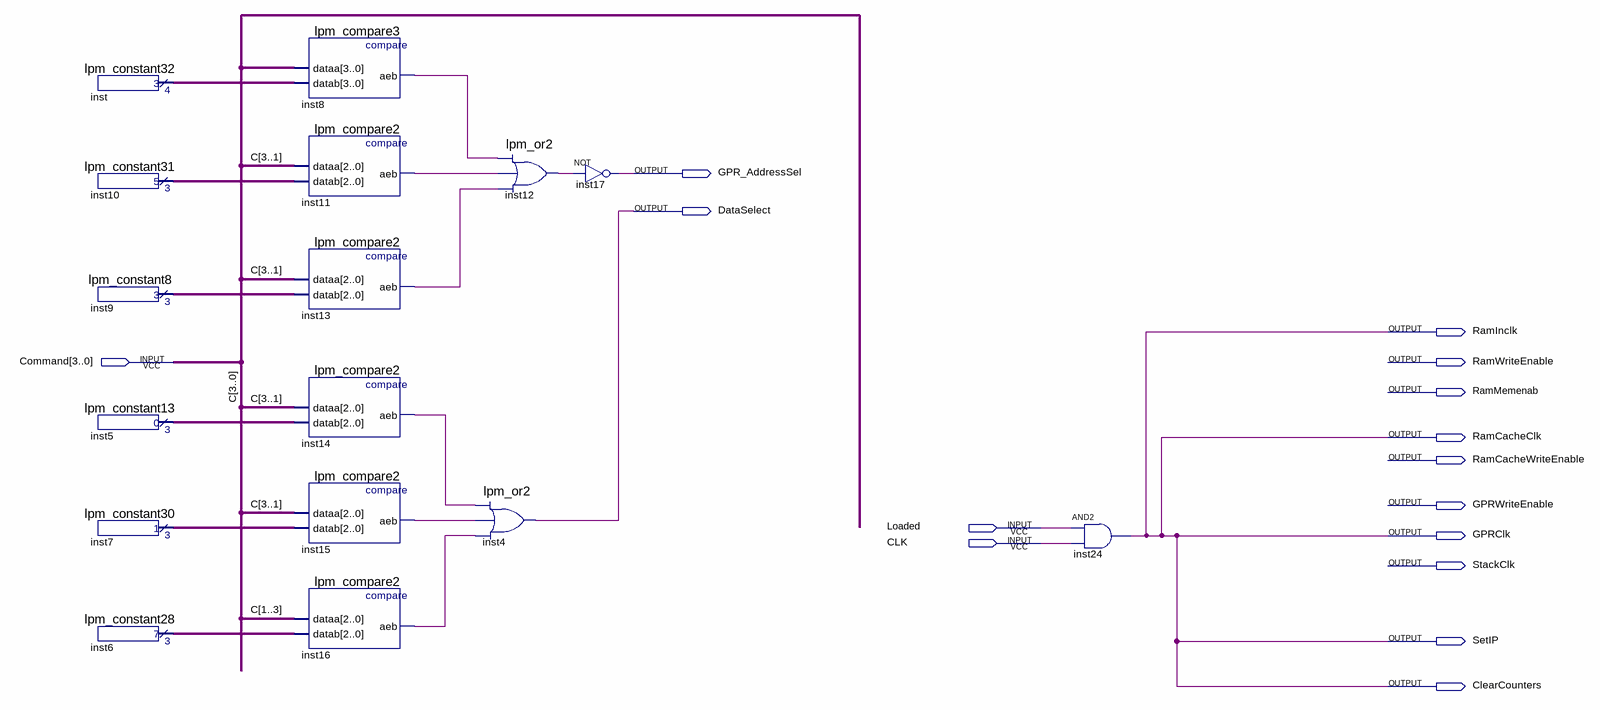
[diagram p0: schematic sheet]
// Quartus schematic SelectDataAndGPRAddress.bdf as structural Verilog: 16 symbols, 15 pins
module SelectDataAndGPRAddress (
  input  [3:0] Command,
  input  Loaded,
  input  CLK,
  output GPR_AddressSel,
  output DataSelect,
  output RamInclk,
  output RamWriteEnable,
  output RamMemenab,
  output RamCacheClk,
  output RamCacheWriteEnable,
  output GPRWriteEnable,
  output GPRClk,
  output StackClk,
  output SetIP,
  output ClearCounters
);

  wire inst8_aeb, inst11_aeb, inst12_result, inst13_aeb, inst14_aeb, inst15_aeb, inst16_aeb;
  wire [2:0] inst5_result, inst6_result, inst7_result, inst9_result, inst10_result;
  wire [3:0] inst_result;

  lpm_constant32 inst (.result(inst_result));
  lpm_constant31 inst10 (.result(inst10_result));
  lpm_constant8 inst9 (.result(inst9_result));
  lpm_constant13 inst5 (.result(inst5_result));
  lpm_constant30 inst7 (.result(inst7_result));
  lpm_constant28 inst6 (.result(inst6_result));
  lpm_compare3 inst8 (.dataa(Command), .datab(inst_result), .aeb(inst8_aeb));
  lpm_compare2 inst11 (.dataa(Command[3:1]), .datab(inst10_result), .aeb(inst11_aeb));
  lpm_compare2 inst13 (.dataa(Command[3:1]), .datab(inst9_result), .aeb(inst13_aeb));
  lpm_compare2 inst14 (.dataa(Command[3:1]), .datab(inst5_result), .aeb(inst14_aeb));
  lpm_compare2 inst15 (.dataa(Command[3:1]), .datab(inst7_result), .aeb(inst15_aeb));
  lpm_compare2 inst16 (.dataa({Command[1], Command[2], Command[3]}), .datab(inst6_result), .aeb(inst16_aeb));
  lpm_or2 inst4 (.data0(inst14_aeb), .data1(inst15_aeb), .data2(inst16_aeb), .result(DataSelect));
  lpm_or2 inst12 (.data0(inst8_aeb), .data1(inst11_aeb), .data2(inst13_aeb), .result(inst12_result));
  not inst17 (GPR_AddressSel, inst12_result);
  and inst24 (ClearCounters, Loaded, CLK);

  assign GPRClk = ClearCounters;
  assign RamCacheClk = ClearCounters;
  assign RamInclk = ClearCounters;
  assign SetIP = ClearCounters;

  // Other names for the same wires on the sheet: C[3:0] = Command
endmodule
